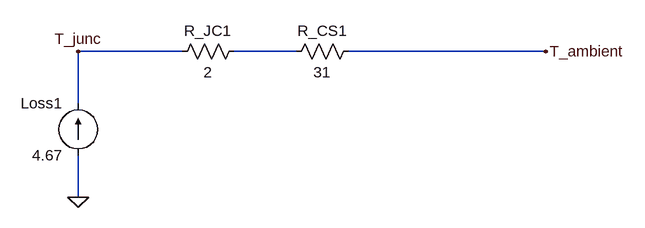
[diagram p0: schematic Thermal_Circuit_Diode.asc]
Thermal_Circuit_Diode.asc, the LTspice schematic file:
Version 4
SHEET 1 880 680
WIRE 176 176 16 176
WIRE 352 176 256 176
WIRE 736 176 432 176
WIRE 16 256 16 176
WIRE 16 400 16 336
FLAG 16 400 0
FLAG 736 176 T_ambient
FLAG 16 176 T_junc
SYMBOL res 272 160 R90
WINDOW 0 0 56 VBottom 2
WINDOW 3 32 56 VTop 2
SYMATTR InstName R_JC1
SYMATTR Value 2
SYMBOL res 448 160 R90
WINDOW 0 0 56 VBottom 2
WINDOW 3 32 56 VTop 2
SYMATTR InstName R_CS1
SYMATTR Value 31
SYMBOL current 16 336 R180
WINDOW 0 24 80 Left 2
WINDOW 3 24 0 Left 2
SYMATTR InstName Loss1
SYMATTR Value 4.67

The netlist it stands for:
* Thermal_Circuit_Diode.asc
R_JC1 N001 T_junc 2
R_CS1 T_ambient N001 31
I§Loss1 0 T_junc 4.67
.backanno
.end